# EAGLE design Gfx_LCD_I2C (EAGLE 5.11)
DATABASE: ./../PARTSDB.TXT; PARTNO: C1608X7R1A105M; TYPE: COG/NPO
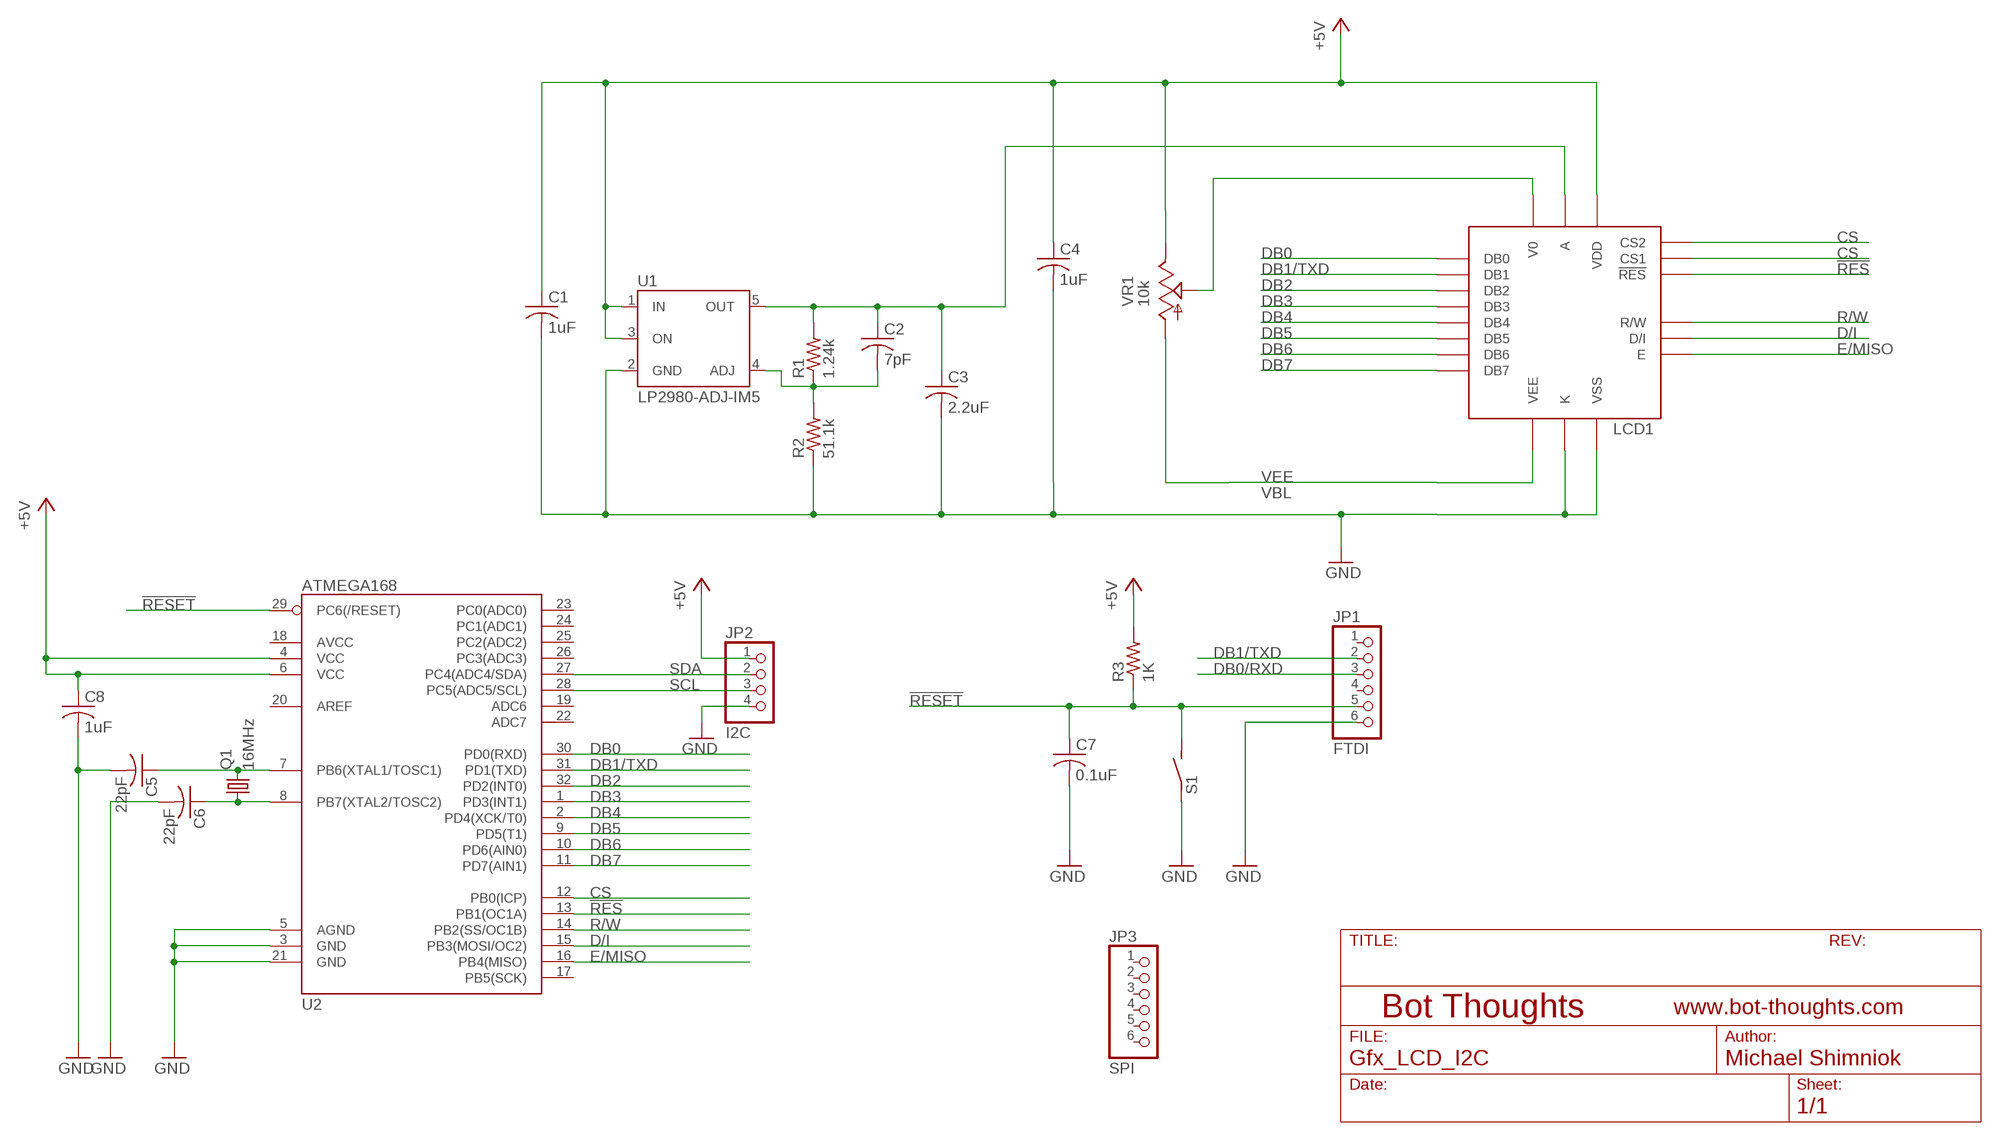
[diagram p0: schematic, sheet 1]

## Parts
C1  1uF  C-USC0603  [C0603]
C2  7pF  C-USC0603  [C0603]
C3  2.2uF  C-USC0603  [C0603]
C4  1uF  C-USC0603  [C0603]
C5  22pF  C-USC0603  [C0603]
C6  22pF  C-USC0603  [C0603]
C7  0.1uF  C-USC0603  [C0603]
C8  1uF  C-USC0603  [C0603]
JP1  FTDI  PINHD-1X06_2.54-S  [1X06-S]
JP2  I2C  PINHD-1X04_2.54-S  [1X04-S]
JP3  SPI  PINHD-1X06_2.54-S  [1X06-S]
LCD1  GDM12864H  [GDM12864H]
Q1  16MHz  CRYSTALCTS406  [CTS406]
R1  1.24k  R-US_R0603  [R0603]
R2  51.1k  R-US_R0603  [R0603]
R3  1K  R-US_R0603  [R0603]
S1  RESET  SPST2EVQ11X09  [EVQ11X09]
U1  LP2980-ADJ-IM5  [SOT23-5]
U2  ATMEGA168  [TQFP32-08]
VR1  10k  TRIM_US-CA6V  [CA6V]

## Nets
!RES: LCD1.P$14(!RES) U2.13(PB1(OC1A))
!RESET: C7.1 JP1.5 R3.1 S1.2 U2.29(PC6(/RESET))
+5V: C1.1 C4.1 C8.1 JP2.1 LCD1.P$1(VDD) R3.2 U1.1(IN) U1.3(ON) U2.4(VCC) U2.6(VCC) VR1.E
CS: LCD1.P$12(CS2) LCD1.P$13(CS1) U2.12(PB0(ICP))
D/I: LCD1.P$16(D/I) U2.15(PB3(MOSI/OC2))
DB0: LCD1.P$4(DB0) U2.30(PD0(RXD))
DB0/RXD: JP1.3
DB1/TXD: JP1.2 LCD1.P$5(DB1) U2.31(PD1(TXD))
DB2: LCD1.P$6(DB2) U2.32(PD2(INT0))
DB3: LCD1.P$7(DB3) U2.1(PD3(INT1))
DB4: LCD1.P$8(DB4) U2.2(PD4(XCK/T0))
DB5: LCD1.P$9(DB5) U2.9(PD5(T1))
DB6: LCD1.P$10(DB6) U2.10(PD6(AIN0))
DB7: LCD1.P$11(DB7) U2.11(PD7(AIN1))
E/MISO: LCD1.P$17(E) U2.16(PB4(MISO))
GND: C1.2 C3.2 C4.2 C5.2 C6.2 C7.2 C8.2 JP1.6 JP2.4 LCD1.P$2(VSS) LCD1.P$20(K) R2.1 S1.1 U1.2(GND) U2.3(GND) U2.5(AGND) U2.21(GND)
N$1: C2.2 R1.1 R2.2 U1.4(ADJ)
N$3: C5.1 Q1.3 U2.7(PB6(XTAL1/TOSC1))
N$4: C6.1 Q1.1 U2.8(PB7(XTAL2/TOSC2))
R/W: LCD1.P$15(R/W) U2.14(PB2(SS/OC1B))
SCL: JP2.3 U2.28(PC5(ADC5/SCL))
SDA: JP2.2 U2.27(PC4(ADC4/SDA))
V0: LCD1.P$3(V0) VR1.S
VBL: C2.1 C3.1 LCD1.P$19(A) R1.2 U1.5(OUT)
VEE: LCD1.P$18(VEE) VR1.A
Unconnected: JP1.1 JP1.4 JP3.1 JP3.2 JP3.3 JP3.4 JP3.5 JP3.6 U2.17(PB5(SCK)) U2.18(AVCC) U2.19(ADC6) U2.20(AREF) U2.22(ADC7) U2.23(PC0(ADC0)) U2.24(PC1(ADC1)) U2.25(PC2(ADC2)) U2.26(PC3(ADC3))

## Library data of the parts
C1-C8 = rcl:C-US: CAPACITOR, American symbol
JP1 JP3 = pinhead-2:PINHD-1X06: PIN HEADER
JP2 = pinhead-2:PINHD-1X04: PIN HEADER
LCD1 = mes:GDM12864H: GDM12864H Graphic LCD
Q1 = crystal:CRYSTAL: CRYSTAL; OC_FARNELL: unknown; OC_NEWARK: unknown
R1-R3 = rcl:R-US_: RESISTOR, American symbol
S1 = ads4:SPST2: SPST Switch
U1 = mes_regulators:LP2980-ADJ: LP2980IM5-ADJ 50mA adjustable, ultra low drop out regulator in SOT-23-5 package
U2 = SparkFun:ATMEGA168
VR1 = pot:TRIM_US-: POTENTIOMETER

## Board
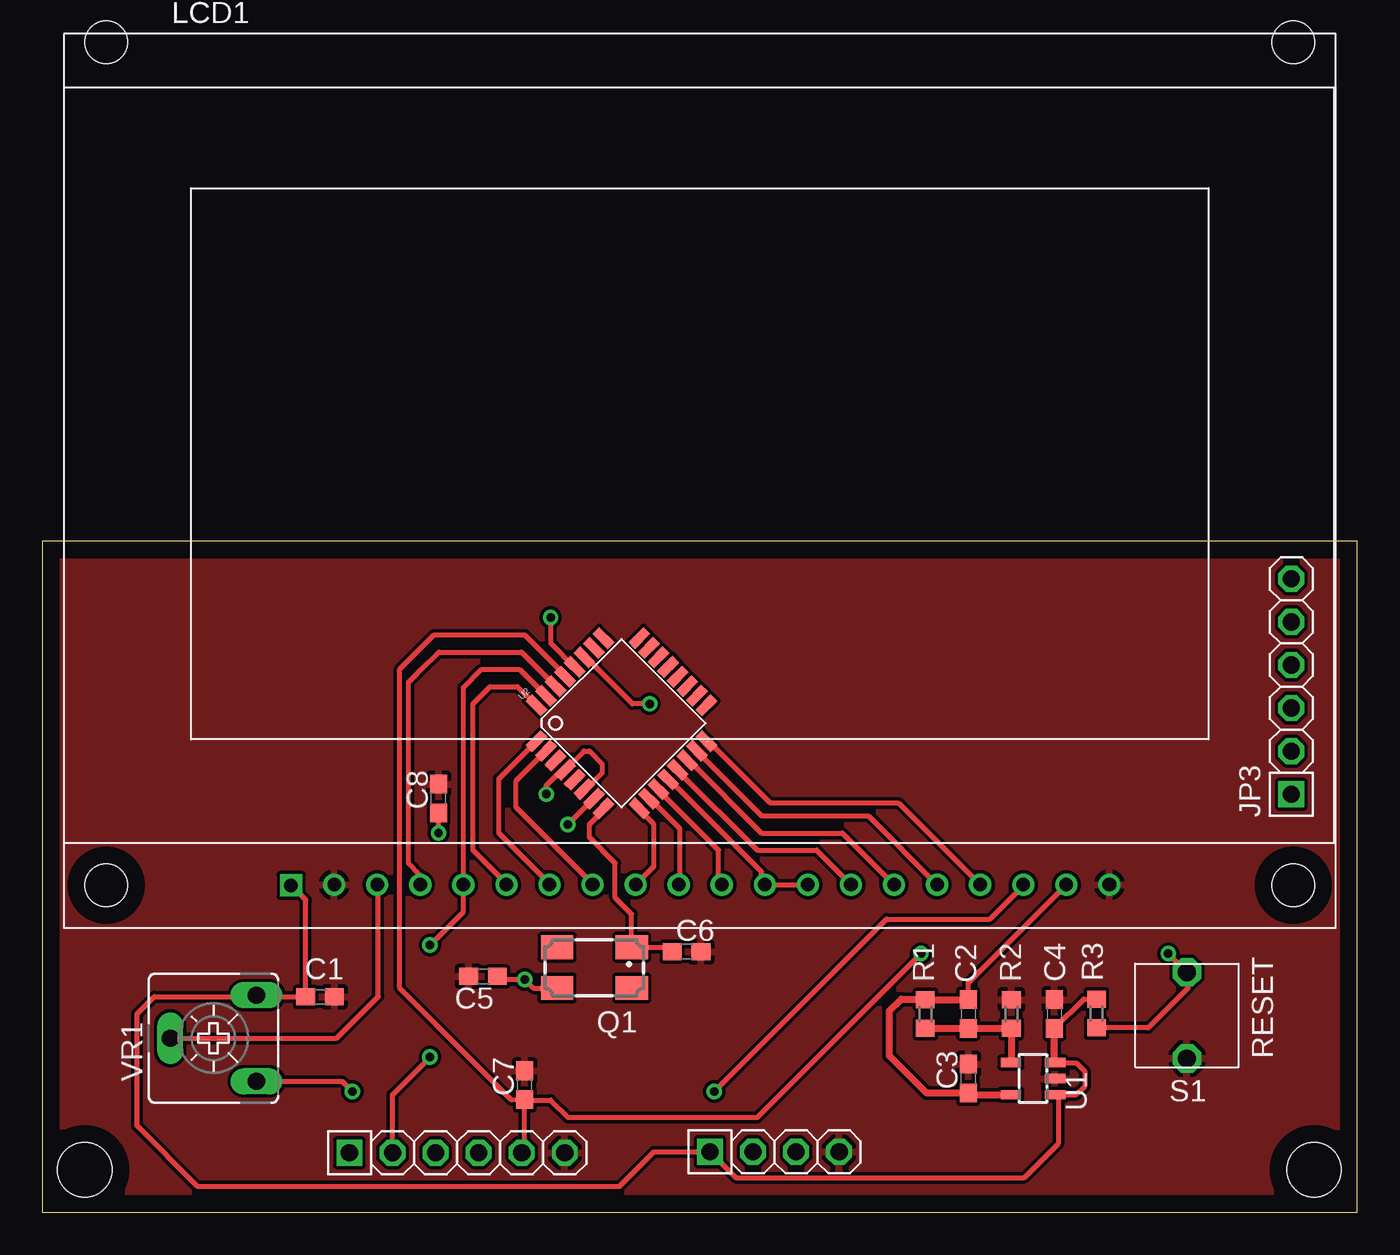
[diagram p1: board, top side]
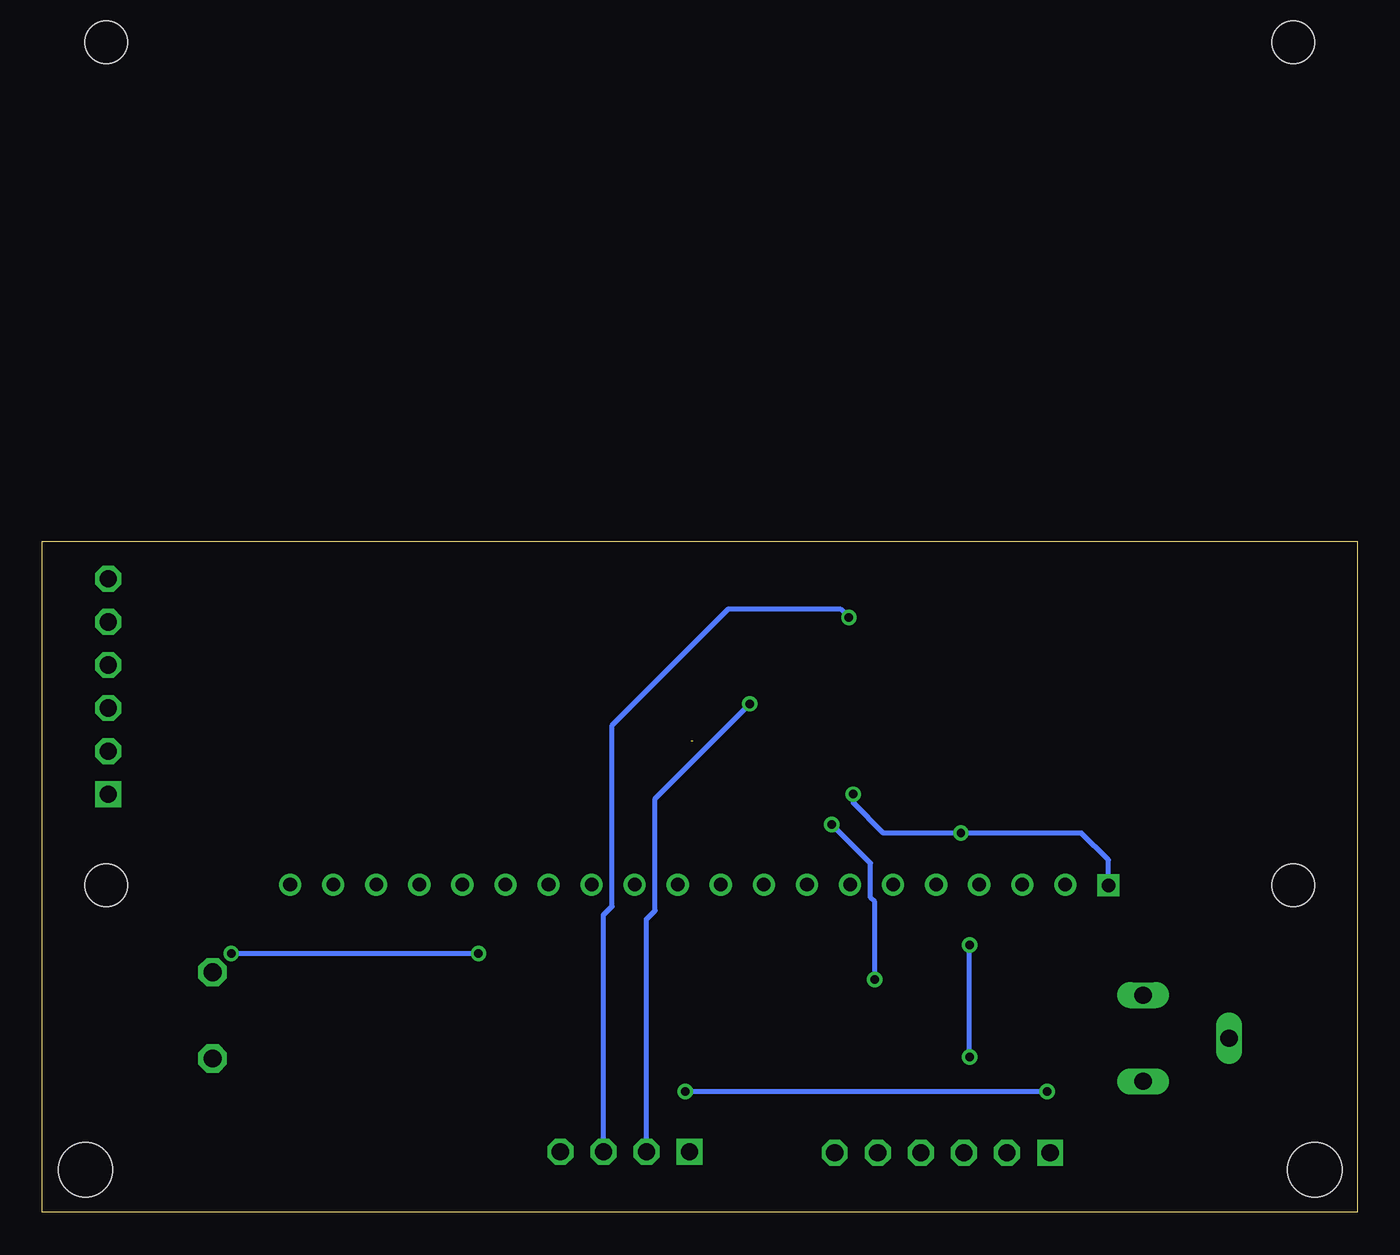
[diagram p2: board, bottom side, seen from below]

Size 77.54 x 39.54 mm. Coordinates in mm from the lower left corner, seen from the top.
Outline: 0,0 77.54,0 77.54,39.54 0,39.54 0,0
Copper layers (1*16): Top 0.035mm / dielectric 1.5mm / Bottom 0.035mm
Design rules "default": minimum track width 10mil, minimum drill 24mil, track to track 8mil, track to pad 8mil, pad to pad 8mil, via to via 8mil, smd to smd 8mil, copper to edge 40mil, drill to drill 8mil, minimum pad ring 10mil, minimum via ring 8mil, stop-mask expansion 4mil, vias tented up to drill 0mil, thermal gap 10mil
Holes 3.2 mm at 2.5,74.56 75,74.56 75,2.5 2.5,2.5

### Footprints (pad centres in the part's own frame; a part is rotated, then mirrored left to right if it is on the bottom)
C0603 = smd 1.1 x 1: 1 -0.85,0; 2 0.85,0
1X06-S = drill 1.016 square: 1 -6.35,0 | drill 1.016 octagon: 2 -3.81,0; 3 -1.27,0; 4 1.27,0; 5 3.81,0; 6 6.35,0
1X04-S = drill 1.016 square: 1 -3.81,0 | drill 1.016 octagon: 2 -1.27,0; 3 1.27,0; 4 3.81,0
GDM12864H = drill 0.8 square: P$1 13.399,2.5 | drill 0.8 round: P$2 15.938,2.54; P$3 18.479,2.54; P$4 21.018,2.54; P$5 23.558,2.54; P$6 26.099,2.54; P$7 28.639,2.54; P$8 31.178,2.54; P$9 33.718,2.54; P$10 36.258,2.54; P$11 38.798,2.54; P$12 41.339,2.54; P$13 43.879,2.54; P$14 46.419,2.54; P$15 48.959,2.54; P$16 51.498,2.54; P$17 54.038,2.54; P$18 56.578,2.54; P$19 59.118,2.54; P$20 61.658,2.54 | hole 2.5: 2.5,2.5; 72.5,2.5; 2.5,52.2; 72.5,52.2
CTS406 = smd 1.9 x 1.4: 1 -2.2,-1.2; 2 2.2,-1.2; 3 2.2,1.2; 4 -2.2,1.2
R0603 = smd 1 x 1.1: 1 -0.85,0; 2 0.85,0
EVQ11X09 = drill 1.041 pad 1.676 octagon: 1 0,0; 2 5.08,0
SOT23-5 = smd 0.55 x 1.2: 1 -0.95,-1.3; 2 0,-1.3; 3 0.95,-1.3; 4 0.95,1.3; 5 -0.95,1.3
TQFP32-08 = smd 1.27 x 0.559: 1 -4.293,2.8; 2 -4.293,2; 3 -4.293,1.2; 4 -4.293,0.4; 5 -4.293,-0.4; 6 -4.293,-1.2; 7 -4.293,-2; 8 -4.293,-2.8; 17 4.293,-2.8; 18 4.293,-2; 19 4.293,-1.2; 20 4.293,-0.4; 21 4.293,0.4; 22 4.293,1.2; 23 4.293,2; 24 4.293,2.8 | smd 0.559 x 1.27: 9 -2.8,-4.293; 10 -2,-4.293; 11 -1.2,-4.293; 12 -0.4,-4.293; 13 0.4,-4.293; 14 1.2,-4.293; 15 2,-4.293; 16 2.8,-4.293; 25 2.8,4.293; 26 2,4.293; 27 1.2,4.293; 28 0.4,4.293; 29 -0.4,4.293; 30 -1.2,4.293; 31 -2,4.293; 32 -2.8,4.293
CA6V = drill 1.016 long: A -2.54,-2.54; E 2.54,-2.54; S 0,2.54

### Placement (x,y rotation side)
C1  16.38,12.69 0 top
C2  54.61,11.68 270 top
C3  54.61,7.87 90 top
C4  59.69,11.68 90 top
C5  25.98,13.9 180 top
C6  37.99,15.36 0 top
C7  28.44,7.49 90 top
C8  23.37,24.38 90 top
JP1  24.46,3.5 0 top
JP2  43.18,3.56 0 top
JP3  73.66,30.99 90 top
LCD1  1.27,16.76 0 top
Q1  32.56,14.41 180 top
R1  52.07,11.68 90 top
R2  57.15,11.68 270 top
R3  62.17,11.71 90 top
S1  67.5,9.06 90 top
U1  58.42,7.87 90 top
U2  34.15,28.82 45 top
VR1  10.09,10.25 90 top

### Tracks (layer width: path | path; a pad name or v marks a point on that pad's centre or on a via)
!RES
  Top 0.305: U2.13 37.47,26.03 42.16,21.34 45.66,21.34 LCD1.P$14
!RESET  (via drill 0.5)
  Top 0.305: R3.1 65.22,10.86 67.56,13.21 S1.2 v66.4,15.24 | U2.29 30.83,31.65 28.45,34.04 23.11,34.04 21.08,32 21.08,13.21 27.68,6.61 C7.1 | v51.82,15.24 42.16,5.59 33.02,5.59 30.99,5.59 29.97,6.6 28.48,6.6 C7.1 | C7.1 28.44,3.67 JP1.5
  Bottom 0.305: v51.82,15.24 v66.4,15.24
+5V  (via drill 0.5)
  Top 0.305: U1.3 59.78,8.76 61,8.76 61.5,8.26 61.5,7.46 60.96,6.92 U1.1 59.94,6.7 59.94,4.06 57.91,2.03 40.89,2.03 JP2.1 36.07,3.56 34.04,1.52 9.14,1.52 5.59,5.08 5.59,11.68 6.6,12.7 12.53,12.7 VR1.E 13.03,12.69 C1.1 15.53,18.4 LCD1.P$1 | C4.1 61.42,12.56 R3.2 | v29.72,24.64 29.72,25.15 30.64,26.07 U2.4 31.94,27.18 32.26,27.18 33.02,26.42 33.02,25.91 32.05,24.94 U2.6 | v23.37,22.35 C8.1
  Top 0.406: U1.3 59.69,8.82 C4.1
  Bottom 0.305: LCD1.P$1 14.67,20.77 16.26,22.35 v23.37,22.35 27.94,22.35 29.72,24.13 v29.72,24.64
CS
  Top 0.305: LCD1.P$13 LCD1.P$12 42.42,19.49 42.42,20.07 36.98,25.51 U2.12
D/I
  Top 0.305: U2.15 38.58,27.2 42.42,23.37 48.7,23.37 LCD1.P$16
DB0
  Top 0.305: LCD1.P$4 22.29,19.88 21.59,20.57 21.59,31.24 22.1,31.75 22.29,31.94 23.37,33.02 28.25,33.02 U2.30
DB1/TXD  (via drill 0.5)
  Top 0.305: U2.31 28.14,32 25.91,32 24.83,30.92 LCD1.P$5 24.83,17.72 v22.86,15.75 | JP1.2 20.65,6.93 v22.86,9.14
  Bottom 0.305: v22.86,9.14 v22.86,15.75
DB2
  Top 0.305: LCD1.P$6 27.37,19.37 25.4,21.34 25.4,29.97 26.42,30.99 28.02,30.99 U2.32
DB3
  Top 0.305: LCD1.P$7 29.91,19.37 26.92,22.35 26.92,25.56 U2.1
DB4
  Top 0.305: LCD1.P$8 32.45,19.37 29.46,22.35 27.94,23.88 27.94,25.44 U2.2
DB5
  Top 0.305: U2.9 35.2,23.73 36.07,22.86 36.07,20.38 LCD1.P$9
DB6
  Top 0.305: U2.10 35.82,24.37 37.59,22.61 37.59,19.37 LCD1.P$10
DB7
  Top 0.305: U2.11 36.34,24.88 39.88,21.34 39.88,19.49 LCD1.P$11
E/MISO  (1 unrouted)
  Top 0.305: 39.29,27.77 42.93,24.13 50.48,24.13 LCD1.P$17
GND
  pour Top: 0,39.55 77.47,39.55 77.47,0 0,0
N$1
  Top 0.406: U1.4 57.15,8.82 R2.2 C2.2 R1.1
N$3  (via drill 0.5)
  Top 0.305: U2.7 32.5,24.37 v30.99,22.86 | Q1.3 28.95,13.21 v28.45,13.72 27.02,13.72 C5.1
  Bottom 0.305: v28.45,13.72 28.45,18.29 28.7,18.54 28.7,20.57 v30.99,22.86
N$4
  Top 0.305: U2.8 33.09,23.7 32.26,22.86 32.26,22.1 33.78,20.57 33.78,18.54 34.76,17.57 Q1.1 36.89,15.61 C6.1
R/W
  Top 0.305: U2.14 38.13,26.64 42.42,22.35 47.18,22.35 LCD1.P$15
SCL  (via drill 0.5)
  Top 0.305: U2.28 31.39,32.1 29.97,33.53 v29.97,35.05
  Bottom 0.305: JP2.3 44.45,17.53 43.94,18.03 43.94,28.7 37.08,35.56 30.48,35.56 v29.97,35.05
SDA  (via drill 0.5)
  Top 0.305: U2.27 32.06,32.71 34.8,29.97 v35.81,29.97
  Bottom 0.305: JP2.2 41.91,17.27 41.4,17.78 41.4,24.38 v35.81,29.97
V0
  Top 0.305: VR1.S 17.37,10.25 19.81,12.7 19.81,19.24 LCD1.P$3
VBL
  Top 0.305: C2.1 54.61,13.53 LCD1.P$19
  Top 0.406: C2.1 R1.2 52.04,12.56 50.65,12.56 49.95,11.86 49.95,9.21 52.14,7.02 C3.1 54.71,6.92 U1.5
VEE  (via drill 0.5)
  Top 0.305: VR1.A 17.69,7.71 v18.29,7.11 | LCD1.P$18 57.85,19.24 55.88,17.27 49.78,17.27 v39.62,7.11
  Bottom 0.305: v18.29,7.11 v39.62,7.11